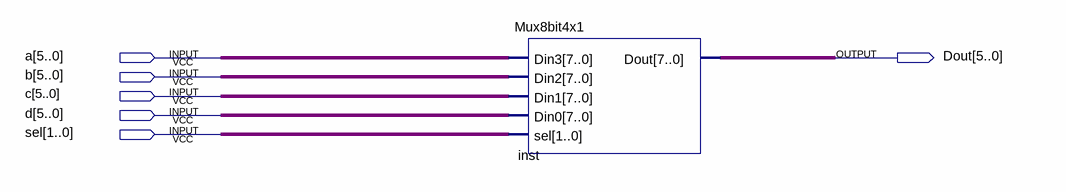
[diagram p0: schematic sheet]
// Quartus schematic TestBed.bdf as structural Verilog: 1 symbols, 6 pins
module TestBed (
  input  [5:0] a,
  input  [5:0] b,
  input  [5:0] c,
  input  [5:0] d,
  input  [1:0] sel,
  output [5:0] Dout
);

  Mux8bit4x1 inst (.Din3(a), .Din2(b), .Din1(c), .Din0(d), .sel(sel), .Dout(Dout));
endmodule
